# Altium schematic sheet PMOD_OV7670.schdoc
size 238 x 107 mm
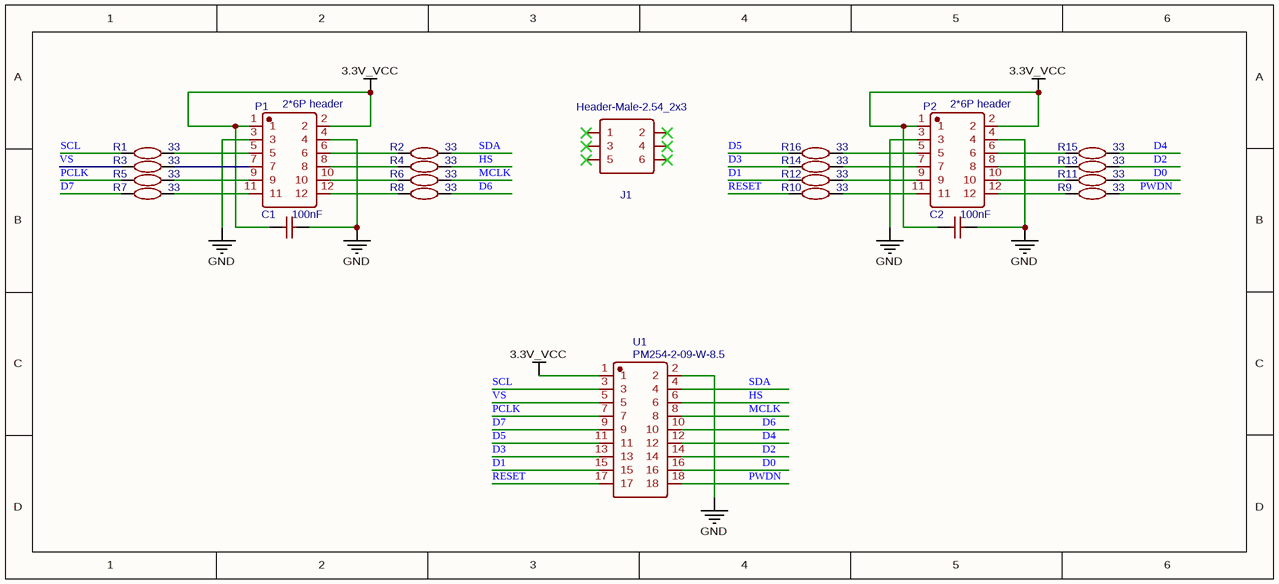
[diagram p0: PMOD_OV7670.schdoc]

## Parts
C1  100nF  [C0603]
C2  100nF  [C0603]
J1  Header-Male-2.54_2x3  [HDR-TH_6P-P2.54-V-M-R2-C3-S2.54-1]
P1  2*6P header  [HDR-TH_12P-P2.54-H-M-R2-C6-S2.54-W12.5]
P2  2*6P header  [HDR-TH_12P-P2.54-H-M-R2-C6-S2.54-W12.5]
R1  33  [R0603]
R2  33  [R0603]
R3  33  [R0603]
R4  33  [R0603]
R5  33  [R0603]
R6  33  [R0603]
R7  33  [R0603]
R8  33  [R0603]
R9  33  [R0603]
R10  33  [R0603]
R11  33  [R0603]
R12  33  [R0603]
R13  33  [R0603]
R14  33  [R0603]
R15  33  [R0603]
R16  33  [R0603]
U1  PM254-2-09-W-8.5  [HDR-TH_18P-P2.54-H-F-R2-C9-W8.5]

## Nets
3.3V_VCC: C1.1 C2.1 P1.1 P1.2 P2.1 P2.2 U1.1
GND: C1.2 C2.2 P1.3 P1.4 P2.3 P2.4 U1.2
D0: R11.2 U1.16
D1: R12.1 U1.15
D2: R13.2 U1.14
D3: R14.1 U1.13
D4: R15.2 U1.12
D5: R16.1 U1.11
D6: R8.2 U1.10
D7: R7.1 U1.9
HS: R4.2 U1.6
MCLK: R6.2 U1.8
PCLK: R5.1 U1.7
PWDN: R9.2 U1.18
RESET: R10.1 U1.17
SCL: R1.1 U1.3
SDA: R2.2 U1.4
VS: R3.1 U1.5
NetP1_5: P1.5 R1.2
NetP1_6: P1.6 R2.1
NetP1_7: P1.7 R3.2
NetP1_8: P1.8 R4.1
NetP1_9: P1.9 R5.2
NetP1_10: P1.10 R6.1
NetP1_11: P1.11 R7.2
NetP1_12: P1.12 R8.1
NetP2_5: P2.5 R16.2
NetP2_6: P2.6 R15.1
NetP2_7: P2.7 R14.2
NetP2_8: P2.8 R13.1
NetP2_9: P2.9 R12.2
NetP2_10: P2.10 R11.1
NetP2_11: P2.11 R10.2
NetP2_12: P2.12 R9.1

Not connected (* = marked no-connect by the designer): J1 1* 2* 3* 4* 5* 6*

## Library data of the parts
C1 C2 = 100nF: BOM_Manufacturer Part: CL10F104ZB8NNNC; BOM_Manufacturer: SAMSUNG; nameAlias: Capacitance; BOM_Supplier: LCSC; BOM_Supplier Part: C1688; BOM_JLCPCB Part Class: Extended Part; spicePre: C; spiceSymbolName: CL10F104ZB8NNNC
J1 = Header-Male-2.54_2x3: BOM_Manufacturer: BOOMELE; BOM_Supplier: LCSC; BOM_Manufacturer Part: Header-Male-2.54_2x3; BOM_Supplier Part: C65114; BOM_JLCPCB Part Class: Extended Part; spicePre: J; spiceSymbolName: Header-Male-2.54_2x3
P1 P2 = 2*6P header: BOM_Manufacturer: BOOMELE; BOM_Supplier: LCSC; BOM_Manufacturer Part: 2*6P header; BOM_Supplier Part: C60565; BOM_JLCPCB Part Class: Extended Part; spicePre: P; spiceSymbolName: 2*6P header
R1-R16 = 33: BOM_Manufacturer: RALEC; BOM_Manufacturer Part: RTT0333R0FTP; nameAlias: Resistance (Ohms); BOM_Supplier: LCSC; BOM_Supplier Part: C103557; BOM_JLCPCB Part Class: Extended Part; spicePre: R; spiceSymbolName: RTT0333R0FTP
U1 = PM254-2-09-W-8.5: BOM_Manufacturer: HCTL(华灿天禄); Contributor: LCSC; BOM_Supplier: LCSC; BOM_Supplier Part: C2897429; BOM_Manufacturer Part: PM254-2-09-W-8.5; spicePre: U; spiceSymbolName: PM254-2-09-W-8.5